# Altium schematic sheet AD5940.SchDoc
size A; SheetNumber: 3; SheetTotal: 3
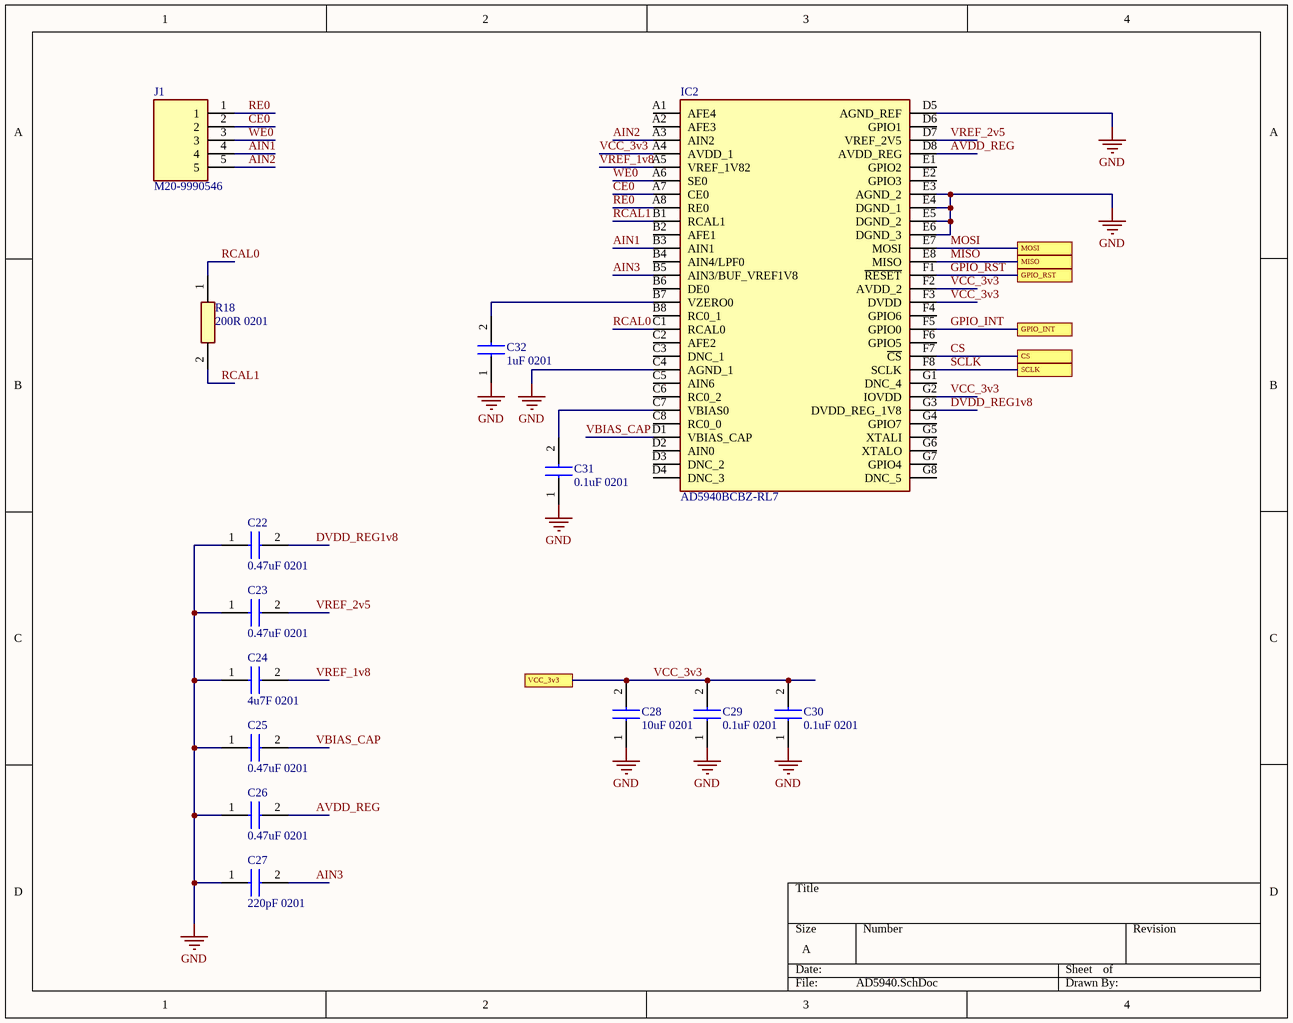
[diagram p0: AD5940.SchDoc]

## Parts
C22  0.47uF 0201  [CAPC0603X33N]
C23  0.47uF 0201  [CAPC0603X33N]
C24  4u7F 0201  [CAPC0603X33N]
C25  0.47uF 0201  [CAPC0603X33N]
C26  0.47uF 0201  [CAPC0603X33N]
C27  220pF 0201  [CAPC0603X33N]
C28  10uF 0201  [CAPC0603X33N]
C29  0.1uF 0201  [CAPC0603X33N]
C30  0.1uF 0201  [CAPC0603X33N]
C31  0.1uF 0201  [CAPC0603X33N]
C32  1uF 0201  [CAPC0603X33N]
IC2  AD5940BCBZ-RL7  [BGA56C40P8X7_416X356X55]
J1  M20-9990546  [HDRV5W64P0X254_1X5_1270X254X610P]
R18  200R 0201  [RESC0603X28N]

## Ports
CS (see AD5940PSTAT[3C]), GPIO_INT (see AD5940PSTAT[3C]), GPIO_RST (see AD5940PSTAT[3B]), MISO (see AD5940PSTAT[3C]), MOSI (see AD5940PSTAT[3C]), SCLK (see AD5940PSTAT[3C]), VCC_3v3 (see AD5940PSTAT[2A], Battery_MGMT[4C])

## Nets
GND: C22.1 C23.1 C24.1 C25.1 C26.1 C27.1 C28.1 C29.1 C30.1 C31.1 C32.1 IC2.C4(AGND_1) IC2.D5(AGND_REF) IC2.E3(AGND_2) IC2.E4(DGND_1) IC2.E5(DGND_2) IC2.E6(DGND_3)
AIN1: IC2.B3(AIN1) J1.4
AIN2: IC2.A3(AIN2) J1.5
AIN3: C27.2 IC2.B5(AIN3/BUF_VREF1V8)
AVDD_REG: C26.2 IC2.D8(AVDD_REG)
CE0: IC2.A7(CE0) J1.2
CS: IC2.F7(~{CS}) ; port CS
DVDD_REG1v8: C22.2 IC2.G3(DVDD_REG_1V8)
GPIO_INT: IC2.F5(GPIO0) ; port GPIO_INT
GPIO_RST: IC2.F1(~{RESET}) ; port GPIO_RST
MISO: IC2.E8(MISO) ; port MISO
MOSI: IC2.E7(MOSI) ; port MOSI
RCAL0: IC2.C1(RCAL0) R18.1
RCAL1: IC2.B1(RCAL1) R18.2
RE0: IC2.A8(RE0) J1.1
SCLK: IC2.F8(SCLK) ; port SCLK
VBIAS_CAP: C25.2 IC2.D1(VBIAS_CAP)
VCC_3v3: C28.2 C29.2 C30.2 IC2.A4(AVDD_1) IC2.F2(AVDD_2) IC2.F3(DVDD) IC2.G2(IOVDD) ; port VCC_3v3
VREF_1v8: C24.2 IC2.A5(VREF_1V82)
VREF_2v5: C23.2 IC2.D7(VREF_2V5)
WE0: IC2.A6(SE0) J1.3
NetC31_2: C31.2 IC2.C7(VBIAS0)
NetC32_2: C32.2 IC2.B7(VZERO0)

Not connected (* = marked no-connect by the designer): IC2 A1(AFE4) A2(AFE3) B2(AFE1) B4(AIN4/LPF0) B6(DE0) B8(RC0_1) C2(AFE2) C3(DNC_1) C5(AIN6) C6(RC0_2) C8(RC0_0) D2(AIN0) D3(DNC_2) D4(DNC_3) D6(GPIO1) E1(GPIO2) E2(GPIO3) F4(GPIO6) F6(GPIO5) G1(DNC_4) G4(GPIO7) G5(XTALI) G6(XTALO) G7(GPIO4) G8(DNC_5)

## Library data of the parts
C22-C32 = 02013A0R5BAT2A: Capacitor; Manufacturer_Name: Kyocera AVX; Datasheet Link: http://www.mouser.com/catalog/supplier/library/pdf/AVXSurfaceMountCeramic.pdf; Height: 0.33mm; Manufacturer_Part_Number: 02013A0R5BAT2A; Mouser Part Number: 581-02013A0R5BAT2A; Mouser Price/Stock: https://www.mouser.co.uk/ProductDetail/KYOCERA-AVX/02013A0R5BAT2A?qs=Thry1QCnmXDPtFIq9lj3NA%3D%3D
IC2 = AD5940BCBZ-RL7: Integrated Circuit; Manufacturer_Name: Analog Devices; Datasheet Link: https://www.analog.com/media/en/technical-documentation/data-sheets/AD5940-5941.pdf; Height: 0.55mm; Manufacturer_Part_Number: AD5940BCBZ-RL7; Mouser Part Number: 584-AD5940BCBZ-RL7; Mouser Price/Stock: https://www.mouser.co.uk/ProductDetail/Analog-Devices/AD5940BCBZ-RL7?qs=vLWxofP3U2xw9N0DLKMjhg%3D%3D; Arrow Part Number: AD5940BCBZ-RL7; Arrow Price/Stock: https://www.arrow.com/en/products/ad5940bcbz-rl7/analog-devices?region=nac
J1 = M20-9990546: Connector; Manufacturer_Name: Harwin; Datasheet Link: https://cdn.harwin.com/pdfs/M20-999.pdf; Height: 6.1mm; Manufacturer_Part_Number: M20-9990546; Mouser Part Number: 855-M20-9990546; Mouser Price/Stock: https://www.mouser.co.uk/ProductDetail/Harwin/M20-9990546?qs=ulE8k0yEMYY8EKyDN9ic6A%3D%3D
R18 = CPF0201D422RE1: Resistor; Manufacturer_Name: TE Connectivity; Datasheet Link: http://www.te.com/commerce/DocumentDelivery/DDEController?Action=showdoc&DocId=Data+Sheet%7F1773200-1%7FA%7Fpdf%7FEnglish%7FENG_DS_1773200-1_A.pdf%7F4-2176215-6; Height: 0.28mm; Manufacturer_Part_Number: CPF0201D422RE1